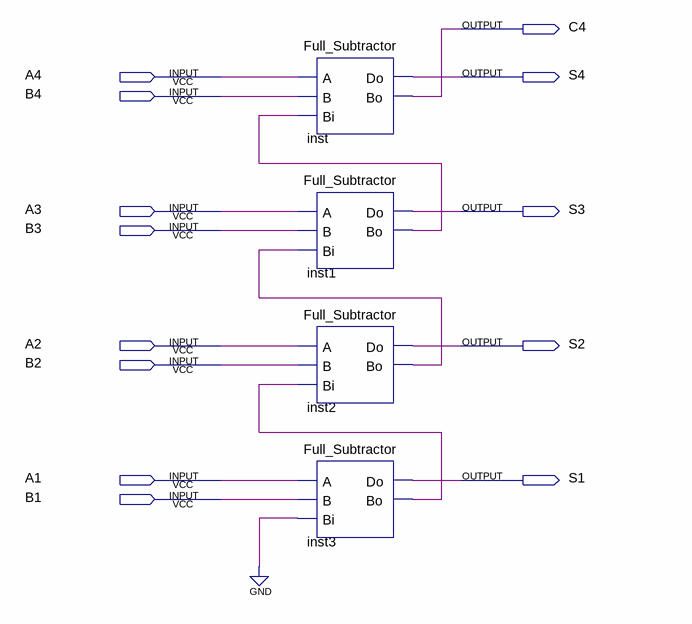
[diagram p0: schematic sheet]
// Quartus schematic 4bit_Full_Subtractor.bdf as structural Verilog: 4 symbols, 13 pins
module \4bit_Full_Subtractor  (
  input  A4,
  input  B4,
  input  A3,
  input  B3,
  input  A2,
  input  B2,
  input  A1,
  input  B1,
  output C4,
  output S4,
  output S3,
  output S2,
  output S1
);

  wire inst1_bo, inst2_bo, inst3_bo;

  Full_Subtractor inst (.A(A4), .B(B4), .Bi(inst1_bo), .Do(S4), .Bo(C4));
  Full_Subtractor inst1 (.A(A3), .B(B3), .Bi(inst2_bo), .Do(S3), .Bo(inst1_bo));
  Full_Subtractor inst2 (.A(A2), .B(B2), .Bi(inst3_bo), .Do(S2), .Bo(inst2_bo));
  Full_Subtractor inst3 (.A(A1), .B(B1), .Bi(1'b0), .Do(S1), .Bo(inst3_bo));
endmodule
